# EasyEDA Pro project Dual_Motor_Driver_V3.1.eprj, schematic Schematic1
Board Name: PCB2; Create Date: 2025-08-30; Page Name: P1; Project Name: Dual_Motor_Driver_V3.1; Schematic Name: Schematic1; Update Date: 2025-08-31; Company: 嘉立创EDA; Page Size: A4; Version: V1.0
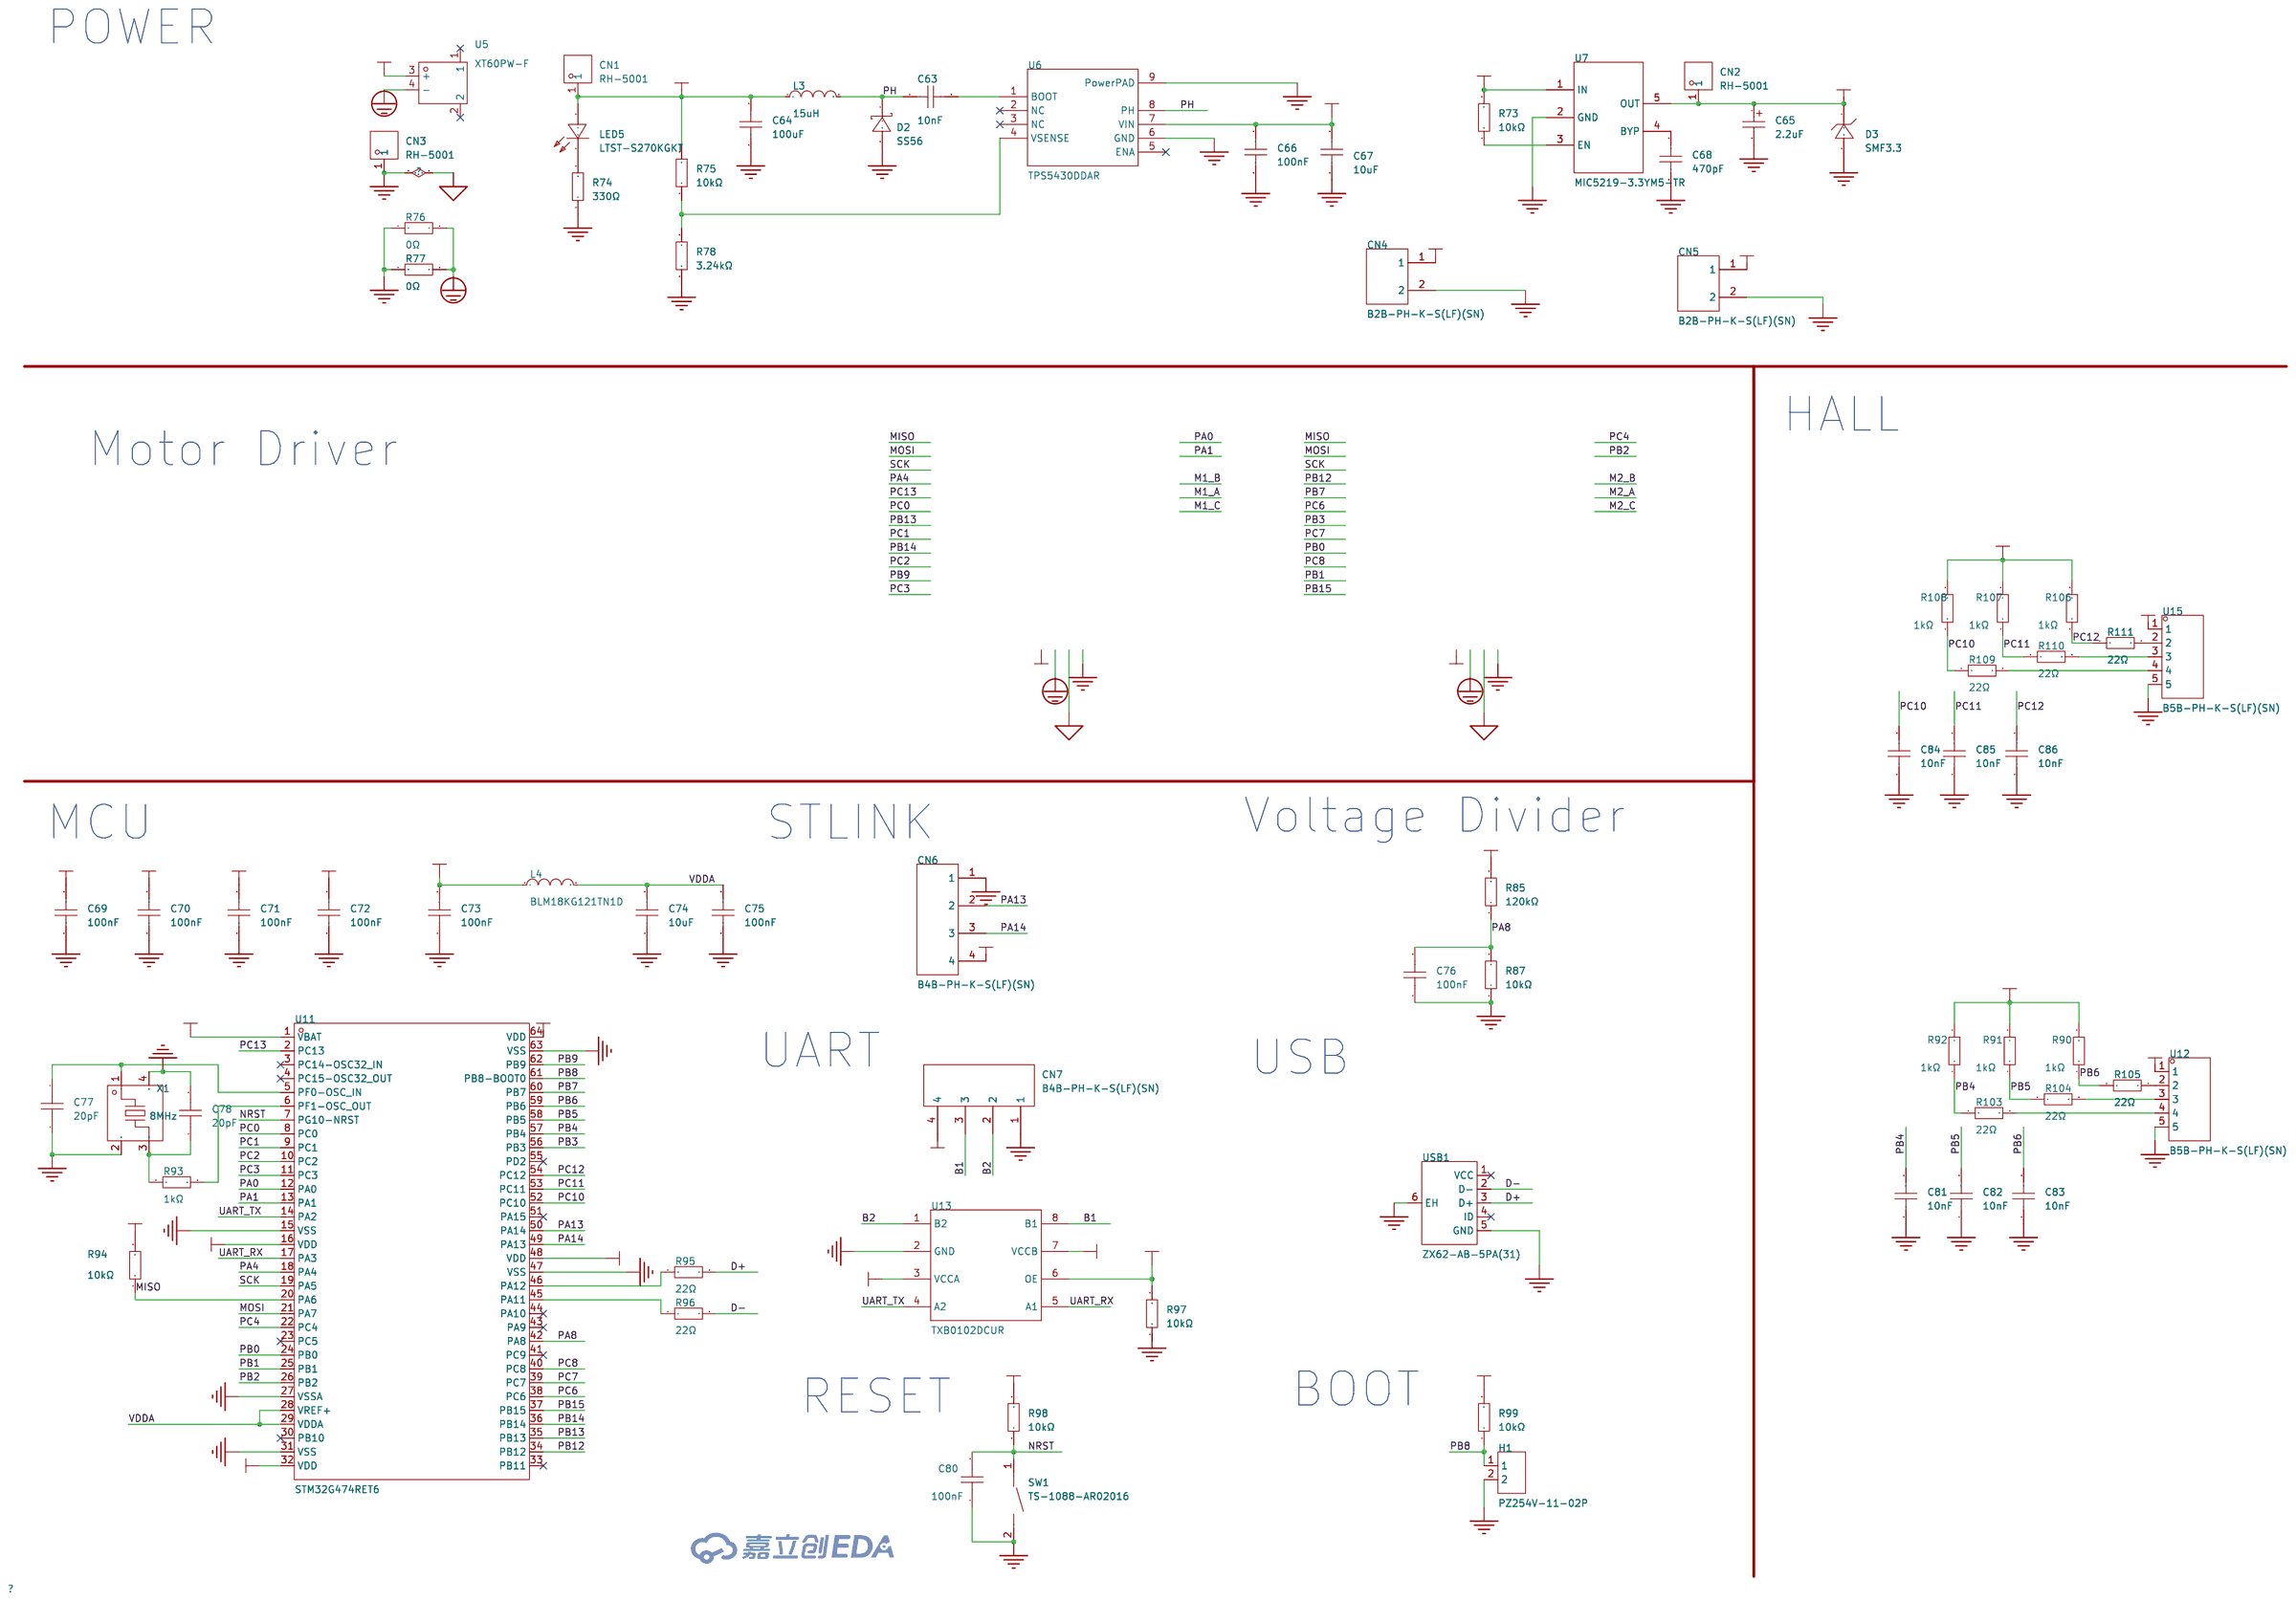
[diagram p1: schematic sheet]

## Parts
C63  10nF  [C0603]
C64  100uF  [CAP-SMD_BD6.3-L6.6-W6.6-LS7.2-R-RD]
C65  2.2uF  [CASE-A_3216]
C66  100nF  [C0603]
C67  10uF  [CAP-SMD_BD5.0-L5.3-W5.3-LS6.0-FD]
C68  470pF  [C0603]
C69  100nF  [C0603]
C70  100nF  [C0603]
C71  100nF  [C0603]
C72  100nF  [C0603]
C73  100nF  [C0603]
C74  10uF  [C0603]
C75  100nF  [C0603]
C76  100nF  [C1206]
C77  20pF  [C0603]
C78  20pF  [C0603]
C80  100nF  [C0603]
C81  10nF  [C0603]
C82  10nF  [C0603]
C83  10nF  [C0603]
C84  10nF  [C0603]
C85  10nF  [C0603]
C86  10nF  [C0603]
CBB1  -
CBB2  -
CN1  RH-5001  [TEST-TH_BD2.54-P1.4_BLACK]
CN2  RH-5001  [TEST-TH_BD2.54-P1.4_BLACK]
CN3  RH-5001  [TEST-TH_BD2.54-P1.4_BLACK]
CN4  B2B-PH-K-S(LF)(SN)  [CONN-TH_B2B-PH-K-S]
CN5  B2B-PH-K-S(LF)(SN)  [CONN-TH_B2B-PH-K-S]
CN6  B4B-PH-K-S(LF)(SN)  [CONN-TH_B4B-PH-K-S]
CN7  B4B-PH-K-S(LF)(SN)  [CONN-TH_B4B-PH-K-S]
D2  SS56  [SMA_L4.3-W2.6-LS5.2-RD]
D3  SMF3.3  [SOD-123FL_L3.0-W1.9-LS3.7-FD]
H1  PZ254V-11-02P  [HDR-TH_2P-P2.54-V-M]
L3  15uH  [IND-SMD_L10.8-W10.0_SLO1040H]
L4  BLM18KG121TN1D  [L0603]
LED5  LTST-S270KGKT  [LED-SMD_L1.7-W0.6-RD]
R73  10kΩ  [R0603]
R74  330Ω  [R0603]
R75  10kΩ  [R0603]
R76  0Ω  [R0603]
R77  0Ω  [R0603]
R78  3.24kΩ  [R0603]
R85  120kΩ  [R1206]
R87  10kΩ  [R1206]
R90  1kΩ  [R0603]
R91  1kΩ  [R0603]
R92  1kΩ  [R0603]
R93  1kΩ  [R0603]
R94  10kΩ  [R0603]
R95  22Ω  [R0603]
R96  22Ω  [R0603]
R97  10kΩ  [R0603]
R98  10kΩ  [R0603]
R99  10kΩ  [R0603]
R103  22Ω  [R0603]
R104  22Ω  [R0603]
R105  22Ω  [R0603]
R106  1kΩ  [R0603]
R107  1kΩ  [R0603]
R108  1kΩ  [R0603]
R109  22Ω  [R0603]
R110  22Ω  [R0603]
R111  22Ω  [R0603]
SW1  TS-1088-AR02016  [SW-SMD_L3.9-W3.0-P4.45]
U5  XT60PW-F  [TH_2P-XT60PW-F]
U6  TPS5430DDAR  [ESOP-8_L4.9-W3.9-P1.27-LS6.0-TL-EP]
U7  MIC5219-3.3YM5-TR  [SOT-23-5_L3.0-W1.7-P0.95-LS2.8-TL]
U11  STM32G474RET6  [LQFP-64_L10.0-W10.0-P0.50-LS12.0-BL]
U12  B5B-PH-K-S(LF)(SN)  [CONN-TH_B5B-PH-K-S-LF-SN]
U13  TXB0102DCUR  [VSSOP-8_L2.4-W2.1-P0.50-LS3.2-BR]
U15  B5B-PH-K-S(LF)(SN)  [CONN-TH_B5B-PH-K-S-LF-SN]
USB1  ZX62-AB-5PA(31)  [MICRO-USB-SMD_ZX62-AB-5PA]
X1  8MHz  [CRYSTAL-SMD_4P-L3.2-W2.5-BL]

## Library data of the parts
C63 = CC0603KRX7R9BB103: 容值:10nF;精度:±10%;额定电压:50V;材质(温度系数):X7R;; LCSC Part Name: 10nF ±10% 50V; Supplier Part: C100042; Manufacturer: YAGEO(国巨); Supplier Footprint: 0603; JLCPCB Part Class: Extended Part; Datasheet: https://atta.szlcsc.com/upload/public/pdf/source/20181008/C309510_22F155564471FAF6A489F7D68F34234E.pdf; Supplier: LCSC; Tolerance: ±10%; Voltage Rated: 50V; Temperature Coefficient: X7R
C64 = VZH101M1ETR-0607: LCSC Part Name: 100uF ±20% 25V; Supplier Part: C311617; Manufacturer: lelon(立隆); Supplier Footprint: SMD,6.3x7.7mm; JLCPCB Part Class: Extended Part; Datasheet: https://atta.szlcsc.com/upload/public/pdf/source/20180930/C311617_94F1283F4013E6085CC80C8D936B2FD6.pdf; Supplier: LCSC; Tolerance: ±20%; Rated Voltage: 25V; φD: 6.3mm; L: 7.7mm; Lifetime @ Temp: 2000hrs@105℃; Operating Temperature: -45℃~+105℃; Check: false
C65 = TAJA225K016RNJ: 容值:2.2uF;精度:±10%;额定电压:16V;等效串联电阻:6.5Ω@100kHz;; LCSC Part Name: 2.2uF ±10% 16V; Supplier Part: C7180; Manufacturer: Kyocera AVX; Supplier Footprint: CASE-A-3216; JLCPCB Part Class: 扩展库; Datasheet: https://atta.szlcsc.com/upload/public/pdf/source/20160107/1457707750344.pdf; Supplier: LCSC; Tolerance: ±10%; Rated Voltage: 16V; Equivalent Series Resistance(ESR): 6.5Ω@100kHz; Operating Temperature: -55℃~+125℃
C66 C69-C73 C75 C80 = CC0603KRX7R9BB104: 容值:100nF;精度:±10%;额定电压:50V;温度系数:X7R;; LCSC Part Name: 100nF ±10% 50V; Supplier Part: C14663; Manufacturer: YAGEO(国巨); Supplier Footprint: 0603; JLCPCB Part Class: Basic Part; Datasheet: https://atta.szlcsc.com/upload/public/pdf/source/20180910/C282072_33301C7F631E79921B82A8DAC6BCC5B3.pdf; Supplier: LCSC; Tolerance: ±10%; Voltage Rating: 50V; Temperature Coefficient: X7R
C67 = JVJ50v10M5x5: 容值:10uF;精度:±20%;额定电压:50V;纹波电流:18mA@120Hz;; LCSC Part Name: 10uF ±20% 50V; Supplier Part: C46550416; Manufacturer: 捷而瑞; Supplier Footprint: SMD,D5xL5.4mm; JLCPCB Part Class: Extended Part; Datasheet: https://atta.szlcsc.com/upload/public/pdf/source/20250526/372E583B5965CEB57A276EA554306514.pdf; Supplier: LCSC; Tolerance: ±20%; Voltage Rating: 50V; Ripple Current: 18mA@120Hz; Diameter: 5mm; Height - Seated (Max): 5.4mm; Operating Temperature: -55℃~+105℃
C68 = CC0603JRNPO9BN471: 容值:470pF;精度:±5%;额定电压:50V;材质(温度系数):NP0;; LCSC Part Name: 470pF ±5% 50V; Supplier Part: C106211; Manufacturer: YAGEO(国巨); Supplier Footprint: 0603; JLCPCB Part Class: Extended Part; Datasheet: https://atta.szlcsc.com/upload/public/pdf/source/20170505/1493957838062.pdf; Supplier: LCSC; Tolerance: ±5%; Voltage Rated: 50V; Temperature Coefficient: NP0
C74 = CL10A106KP8NNNC: 容值:10uF;精度:±10%;额定电压:10V;材质(温度系数):X5R;; LCSC Part Name: 10uF ±10% 10V; Supplier Part: C19702; Manufacturer: SAMSUNG(三星); Supplier Footprint: 0603; JLCPCB Part Class: Basic Part; Datasheet: https://atta.szlcsc.com/upload/public/pdf/source/20160218/1457707763339.pdf; Supplier: LCSC; Tolerance: ±10%; Voltage Rated: 10V; Temperature Coefficient: X5R
C76 = GRM31C5C1H104JA01L: 容值:100nF;精度:±5%;额定电压:50V;材质(温度系数):C0G;; LCSC Part Name: 100nF ±5% 50V; Supplier Part: C97946; Manufacturer: muRata(村田); Supplier Footprint: 1206; JLCPCB Part Class: Extended Part; Datasheet: https://atta.szlcsc.com/upload/public/pdf/source/20180228/C97946_15198056954501377706.pdf; Supplier: LCSC; Tolerance: ±5%; Voltage Rated: 50V; Temperature Coefficient: C0G
C77 C78 = CC0603FRNPO9BN200: 容值:20pF;精度:±1%;额定电压:50V;材质(温度系数):NP0;; LCSC Part Name: 20pF ±1% 50V; Supplier Part: C326779; Manufacturer: YAGEO(国巨); Supplier Footprint: 0603; JLCPCB Part Class: Extended Part; Datasheet: https://atta.szlcsc.com/upload/public/pdf/source/20181031/C326779_4C607DD48C96BB53EFC11FE773ED8662.pdf; Supplier: LCSC; Tolerance: ±1%; Voltage Rated: 50V; Temperature Coefficient: NP0
C81-C86 = CAP_0603: Supplier Footprint: 0603
CN1-CN3 = RH-5001: 测试针  高温尼龙/磷青铜镀银 5001测试点 100x80mm; LCSC Part Name: PCB电路板测试点/测试针; Supplier Part: C5199801; Manufacturer: 荣和; JLCPCB Part Class: 扩展库; Datasheet: https://atta.szlcsc.com/upload/public/pdf/source/20240125/4C7D900D13ECC10386B63F24462DBAAB.pdf; Supplier: LCSC; Connector Type: 插针型(穿板); Plastic Color: 黑色; Board Space (Diameter φ/ Length x Width): 2.5mm
CN4 CN5 = B2B-PH-K-S(LF)(SN): 插针结构:1x2P;间距:2mm;安装方式:直插;参考系列:PH;总PIN数:2P;排数:1;每排PIN数:2;行距:-;额定电流:2A;触头材质:黄铜;触头镀层:锡;工作温度范围:-25℃~+85℃;; LCSC Part Name: 1x2P 间距:2mm 直插 系列:PH; Supplier Part: C131337; Manufacturer: JST; Supplier Footprint: 插件,P=2mm; JLCPCB Part Class: 扩展库; Datasheet: https://atta.szlcsc.com/upload/public/pdf/source/20171026/C131342_15089839687311058815.pdf; Supplier: LCSC; Pins Structure: 1x2P; Pitch: 2mm; Mounting Type: 直插; Reference Series: PH; Number of Pins: 2P; Number of Rows: 1; Number of PINs Per Row: 2; Current Rating: 2A; Contact Material: 黄铜; Contact Plating: 锡; Operating Temperature: -25℃~+85℃; Voltage Rating: 100V; Plastic Material: PA66; Flame Retardant Rating: UL94V-0; Supplementary Features: 打K脚; Color: 白色; Z-Height of the Board: 6mm; X-Length of Bottom Edge on Board (Spacing Line): 5.9mm; Y-Width of Bottom Edge on Board: 4.5mm
CN6 CN7 = B4B-PH-K-S(LF)(SN): 插针结构:1x4P;间距:2mm;安装方式:直插;参考系列:PH;总PIN数:4P;排数:1;每排PIN数:4;行距:-;额定电流:2A;触头材质:黄铜;触头镀层:锡;工作温度范围:-25℃~+85℃;; LCSC Part Name: 1x4P 间距:2mm 直插 系列:PH; Supplier Part: C131334; Manufacturer: JST; Supplier Footprint: 插件,P=2mm; JLCPCB Part Class: 扩展库; Datasheet: https://atta.szlcsc.com/upload/public/pdf/source/20171026/C131342_15089839687311058815.pdf; Supplier: LCSC; Pins Structure: 1x4P; Pitch: 2mm; Mounting Style: 直插; Reference Series: PH; Number of Pins: 4P; Number of Rows: 1; Number of PINs Per Row: 4; Current Rating (Max): 2A; Contact Material: 黄铜; Contact Plating: 锡; Operating Temperature Range: -25℃~+85℃; Rated Voltage (Max): 100V; Plastic Material: PA66; Flame Retardant Rating: UL94V-0; Supplementary Features: 打K脚; Colour: 白色; Z-Height of the Board: 6mm; X-Length of Bottom Edge on Board (Spacing Line): 9.9mm; Y-Width of Bottom Edge on Board: 4.5mm
D2 = SS56_C65009: 二极管配置:独立式;正向压降(Vf):700mV@5A;直流反向耐压(Vr):60V;整流电流:5A;; LCSC Part Name: 电压:60V 电流:5A; Supplier Part: C65009; Manufacturer: MDD(辰达半导体); Supplier Footprint: SMA(DO-214AC); JLCPCB Part Class: Extended Part; Datasheet: https://atta.szlcsc.com/upload/public/pdf/source/20240710/73DFBB65C1883B895E62D589679033DF.pdf; Supplier: LCSC; Diode Configuration: 独立式; Forward Voltage (Vf@If): 700mV@5A; Reverse Voltage (Vr): 60V; Rectified Current: 5A; Reverse Leakage Current (Ir): 1mA@60V
D3 = SMF3.3: 反向截止电压(Vrwm):3.3V;最大钳位电压:6.8V;峰值脉冲电流(Ipp)@10/1000us:30A;峰值脉冲功率(Ppp)@10/1000us:200W;击穿电压:3.4V;; Supplier Part: C2649858; Manufacturer: Littelfuse(美国力特); Supplier Footprint: SOD-123FL; JLCPCB Part Class: Extended Part; Datasheet: https://atta.szlcsc.com/upload/public/pdf/source/20210611/50E5D37DD0B56B29EBADFDB41F7ACD9C.pdf; Supplier: LCSC; Reverse Stand-Off Voltage (Vrwm): 3.3V; Maximum Clamping Voltage: 6.8V; Peak Pulse Current (Ipp)@10/1000us: 30A; Peak Pulse Power Dissipation (Ppp)@10/1000us: 200W; Breakdown Voltage: 3.4V; Type: TVS
H1 = PZ254V-11-02P: 插针结构:1x2P;间距:2.54mm;行距:-;圆针/方针:方针;安装方式:直插;排数:单排;总PIN位数:2P;额定电流:-;额定电压:-;配合针长度:6mm;塑高:2.5mm;端接针长度:3mm;触头材质:黄铜;触头镀层:-;工作温度:-40℃~+105℃;颜色:黑色;; LCSC Part Name: 1x2P 间距:2.54mm 方针 直插; Supplier Part: C492401; Manufacturer: XFCN(兴飞); Supplier Footprint: 插件,P=2.54mm; JLCPCB Part Class: 扩展库; Datasheet: https://atta.szlcsc.com/upload/public/pdf/source/20200309/C492401_A812433581A9B211A7FFA413ADDFF0E5.pdf; Supplier: LCSC; Pin Structure: 1x2P; Pitch: 2.54mm; Circluar Pins/Square Pins: 方针; Mounting Type: 直插; Number of Rows: 单排; Number of Pins: 2P; Length of Mating Pin: 6mm; Insulation Height: 2.5mm; Length of End Connection Pin: 3mm; Contact Material: 黄铜; Operating Temperature: -40℃~+105℃; Color: 黑色
L3 = SLO1040H150MTT: 精度:±20%;额定电流:4.5A;直流电阻(DCR):45mΩ;电感值:15uH;; LCSC Part Name: 15uH ±20%; Supplier Part: C182184; Manufacturer: Sunltech(韩国顺磁); Supplier Footprint: SMD; JLCPCB Part Class: Extended Part; Datasheet: https://atta.szlcsc.com/upload/public/pdf/source/20180227/C182184_15197211288301371908.pdf; Supplier: LCSC; Width: 10mm; Tolerance: ±20%; Length: 10.8mm; Rated Current: 4.5A; DC Resistance (DCR): 45mΩ; Height: 4mm; Check: false
L4 = BLM18KG121TN1D: 标称阻抗@测试频率:120Ω@100MHz;误差:±25%;直流电阻(RDC):30mΩ;; LCSC Part Name: 单路 0603磁珠 阻抗120Ω@100MHz; Supplier Part: C85831; Manufacturer: muRata(村田); Supplier Footprint: 0603; JLCPCB Part Class: 扩展库; Datasheet: https://atta.szlcsc.com/upload/public/pdf/source/20180329/C160981_FD3C2D2622A377E203B89F4AA32B0741.pdf; Supplier: LCSC; Impedance @ Frequency: 120Ω@100MHz; Tolerance: ±25%; DC Resistance: 30mΩ; Current Rating: 3A; Circuits: 1
LED5 = LTST-S270KGKT: 发光颜色:黄绿色;功率:75mW;正向电流:20mA;主波长:571nm;二极管配置:-;透镜颜色:无色透明透镜;色温:-;发光角度:130°;载带方式:侧贴;工作温度:-30℃~+85℃;; LCSC Part Name: 普绿/黄绿 侧贴; Supplier Part: C125113; Manufacturer: LITEON(光宝); Supplier Footprint: SMD,1.2x1.6mm; JLCPCB Part Class: 扩展库; Datasheet: https://atta.szlcsc.com/upload/public/pdf/source/20180104/C125113_15150602232371230485.pdf; Supplier: LCSC; Emitted Color: 黄绿色; Power Dissipation: 75mW; Forward Current: 20mA; Dominant Wavelength: 571nm; Peak Wavelength: 574nm; Lens Color: 无色透明透镜; Viewing Angle: 130°; Mounting Sytle: 侧贴; Operating Temperature: -30℃~+85℃
R73 R75 R94 R97-R99 = 0603WAF1002T5E: 电阻类型:厚膜电阻;阻值:10kΩ;精度:±1%;功率:100mW;工作电压:75V;温度系数:±100ppm/℃;; LCSC Part Name: 厚膜电阻 10kΩ ±1% 100mW; Supplier Part: C25804; Manufacturer: UNI-ROYAL(厚声); Supplier Footprint: 0603; JLCPCB Part Class: Basic Part; Datasheet: https://atta.szlcsc.com/upload/public/pdf/source/20200306/C422600_1E6D84923E4A46A82E41ADD87F860B5C.pdf; Supplier: LCSC; Type: 厚膜电阻; Tolerance: ±1%; Power(Watts): 100mW; Overload Voltage (Max): 75V; Temperature Coefficient: ±100ppm/℃; Operating Temperature Range: -55℃~+155℃; Voltage-Supply(Max): 75V; Operating Temperature: -55℃~+155℃
R74 = 0603WAF3300T5E: 电阻类型:厚膜电阻;阻值:330Ω;精度:±1%;功率:100mW;最大工作电压:75V;温度系数:±100ppm/℃;; LCSC Part Name: 330Ω ±1% 100mW 厚膜电阻; Supplier Part: C23138; Manufacturer: UNI-ROYAL(厚声); Supplier Footprint: 0603; JLCPCB Part Class: Basic Part; Datasheet: https://atta.szlcsc.com/upload/public/pdf/source/20200306/C422600_1E6D84923E4A46A82E41ADD87F860B5C.pdf; Supplier: LCSC; Type: 厚膜电阻; Tolerance: ±1%; Power(Watts): 100mW; Overload Voltage (Max): 75V; Temperature Coefficient: ±100ppm/℃; Operating Temperature Range: -55℃~+155℃
R76 R77 = RC0603FR-070RL: 电阻类型:厚膜电阻;阻值:0Ω;精度:±1%;功率:100mW;最大工作电压:75V;温度系数:-;; LCSC Part Name: 厚膜电阻 0Ω ±1% 100mW; Supplier Part: C100044; Manufacturer: YAGEO(国巨); Supplier Footprint: 0603; JLCPCB Part Class: Extended Part; Datasheet: https://atta.szlcsc.com/upload/public/pdf/source/20180316/70C0E2BDAE7FCC62C531A5A58D202EE1.pdf; Supplier: LCSC; Type: 厚膜电阻; Tolerance: ±1%; Power(Watts): 100mW; Overload Voltage (Max): 75V; Operating Temperature Range: -55℃~+155℃
R78 = 0603WAF3241T5E: 电阻类型:厚膜电阻;阻值:3.24kΩ;精度:±1%;功率:100mW;最大工作电压:75V;温度系数:±100ppm/℃;; LCSC Part Name: 3.24kΩ ±1% 100mW 厚膜电阻; Supplier Part: C22994; Manufacturer: UNI-ROYAL(厚声); Supplier Footprint: 0603; JLCPCB Part Class: Extended Part; Datasheet: https://atta.szlcsc.com/upload/public/pdf/source/20200306/C422600_1E6D84923E4A46A82E41ADD87F860B5C.pdf; Supplier: LCSC; Type: 厚膜电阻; Tolerance: ±1%; Power(Watts): 100mW; Overload Voltage (Max): 75V; Temperature Coefficient: ±100ppm/℃; Operating Temperature Range: -55℃~+155℃
R85 = 1206W4F1203T5E: 电阻类型:厚膜电阻;阻值:120kΩ;精度:±1%;功率:250mW;最大工作电压:200V;温度系数:±100ppm/℃;; LCSC Part Name: 120kΩ ±1% 250mW 厚膜电阻; Supplier Part: C17908; Manufacturer: UNI-ROYAL(厚声); Supplier Footprint: 1206; JLCPCB Part Class: Extended Part; Datasheet: https://atta.szlcsc.com/upload/public/pdf/source/20200306/C422600_1E6D84923E4A46A82E41ADD87F860B5C.pdf; Supplier: LCSC; Type: 厚膜电阻; Tolerance: ±1%; Power(Watts): 250mW; Overload Voltage (Max): 200V; Temperature Coefficient: ±100ppm/℃; Operating Temperature Range: -55℃~+155℃
R87 = 1206W4F1002T5E: 电阻类型:厚膜电阻;阻值:10kΩ;精度:±1%;功率:250mW;最大工作电压:200V;温度系数:±100ppm/℃;; LCSC Part Name: 10kΩ ±1% 250mW 厚膜电阻; Supplier Part: C17902; Manufacturer: UNI-ROYAL(厚声); Supplier Footprint: 1206; JLCPCB Part Class: Basic Part; Datasheet: https://atta.szlcsc.com/upload/public/pdf/source/20200306/C422600_1E6D84923E4A46A82E41ADD87F860B5C.pdf; Supplier: LCSC; Type: 厚膜电阻; Tolerance: ±1%; Power(Watts): 250mW; Overload Voltage (Max): 200V; Temperature Coefficient: ±100ppm/℃; Operating Temperature Range: -55℃~+155℃
R90-R92 R106-R108 = 0603WAF1002T5E: LCSC Part Name: 10kΩ ±1% 100mW; Supplier Part: C25804; Manufacturer: UNI-ROYAL(厚声); Supplier Footprint: 0603; JLCPCB Part Class: Basic Part; Datasheet: https://atta.szlcsc.com/upload/public/pdf/source/20200306/C422600_1E6D84923E4A46A82E41ADD87F860B5C.pdf; Supplier: LCSC; Type: 厚膜电阻; Tolerance: ±1%; Power(Watts): 100mW; Temperature Coefficient: ±100ppm/℃; Overload Voltage (Max): 75V; Operating Temperature Range: -55℃~+155℃
R93 = 0603WAF1001T5E: 电阻类型:厚膜电阻;阻值:1kΩ;精度:±1%;功率:100mW;最大工作电压:75V;温度系数:±100ppm/℃;; LCSC Part Name: 1kΩ ±1% 100mW 厚膜电阻; Supplier Part: C21190; Manufacturer: UNI-ROYAL(厚声); Supplier Footprint: 0603; JLCPCB Part Class: Basic Part; Datasheet: https://atta.szlcsc.com/upload/public/pdf/source/20200306/C422600_1E6D84923E4A46A82E41ADD87F860B5C.pdf; Supplier: LCSC; Type: 厚膜电阻; Tolerance: ±1%; Power(Watts): 100mW; Overload Voltage (Max): 75V; Temperature Coefficient: ±100ppm/℃; Operating Temperature Range: -55℃~+155℃
R95 R96 = 0603WAF220JT5E: 电阻类型:厚膜电阻;阻值:22Ω;精度:±1%;功率:100mW;最大工作电压:75V;温度系数:±100ppm/℃;; LCSC Part Name: 22Ω ±1% 100mW 厚膜电阻; Supplier Part: C23345; Manufacturer: UNI-ROYAL(厚声); Supplier Footprint: 0603; JLCPCB Part Class: Basic Part; Datasheet: https://atta.szlcsc.com/upload/public/pdf/source/20200306/C422600_1E6D84923E4A46A82E41ADD87F860B5C.pdf; Supplier: LCSC; Type: 厚膜电阻; Tolerance: ±1%; Power(Watts): 100mW; Overload Voltage (Max): 75V; Temperature Coefficient: ±100ppm/℃; Operating Temperature Range: -55℃~+155℃
R103-R105 R109-R111 = Res_0603: Supplier Footprint: 0603
SW1 = TS-1088-AR02016: 电路结构:单刀单掷;按钮形状:圆形按钮;作用力:160gf;安装方式:立贴;开关长度:4mm;开关宽度:3mm;开关高度:2mm;带支架:不带;触点电流:50mA;额定电压(DC):12V;绝缘电阻:100MΩ;机械寿命:10万次;; LCSC Part Name: 4*3*2mm 立贴 轻触开关; Supplier Part: C720477; Manufacturer: XUNPU(讯普); Supplier Footprint: SMD; JLCPCB Part Class: 基础库; Datasheet: https://atta.szlcsc.com/upload/public/pdf/source/20200810/C720475_60D09DD6C54279ADDB2DC25100F1CC11.pdf; Supplier: LCSC; Circuit: 单刀单掷; Actuator Style: 圆形按钮; Operating Force: 160gf; Mounting Style: 立贴; Switch Length: 4mm; Switch Width: 3mm; Switch Height: 2mm; Strike Gundam: 不带; Contact Current: 50mA; Voltage Rating (DC): 12V; Insulation Resistance: 100MΩ; Actuator/Cap Color: 黑色; Pin Style: SMD接片; Mechanical Life: 10万次; Operating Temperature: -30℃~+80℃
U5 = XT60PW-F: 类别:-;类型1:-;; LCSC Part Name: AMASS(艾迈斯)插头连接器锂电池组充电接口 航模电调卧式焊板 母头 XT60PW-F; Supplier Part: C428722; Manufacturer: AMASS(艾迈斯); JLCPCB Part Class: 扩展库; Datasheet: https://atta.szlcsc.com/upload/public/pdf/source/20190916/C428722_DFF78979486FCB0B58C1FC563067EC88.pdf; Supplier: LCSC; Type: 卧式插头; Colour: 黄色; InterfaceType: 母头
U6 = TPS5430DDAR: 功能类型:降压型;输出类型:可调;工作电压:5.5V~36V;输出电压:1.221V~32.04V;输出电流:3A;; LCSC Part Name: 宽输入范围、3A输出电流的降压转换器; Supplier Part: C9864; Manufacturer: TI(德州仪器); Supplier Footprint: SOIC-8-EP; JLCPCB Part Class: 基础库; Datasheet: https://www.ti.com/cn/lit/gpn/tps5430; Supplier: LCSC; Function: 降压型; Output Type: 可调; Input Voltage: 5.5V~36V; Output Voltage: 1.221V~32.04V; Output Current: 3A; Switching Frequency: 500kHz; Operating Temperature: -40℃~+125℃@(TJ); Synchronous Rectification: 否; Number of Outputs: 1; Topology: 降压式; Switch tube (built-in/external): 内置
U7 = MIC5219-3.3YM5-TR: 输出类型:固定;最大输入电压:12V;输出电压:3.3V;输出电流:500mA;电源纹波抑制比(PSRR):75dB@(120Hz);输出极性:正极;; LCSC Part Name: 500mA峰值输出低压差线性稳压器; Supplier Part: C29613; Manufacturer: MICROCHIP(美国微芯); Supplier Footprint: SOT-23-5; JLCPCB Part Class: 扩展库; Datasheet: https://atta.szlcsc.com/upload/public/pdf/source/20180115/C144182_15159955638901266895.pdf; Supplier: LCSC; Output Type: 固定; Maximum Input Voltage: 12V; Output Voltage: 3.3V; Output Current: 500mA; Power Supply Rejection Ratio (PSRR): 75dB@(120Hz); Dropout Voltage: 600mV@(500mA); standby current: 8uA; Feature: 浪涌保护；热保护(TSD)；过流保护(OCP)；带使能; Operating Temperature: -40℃~+125℃; Output Polarity: 正极; Number of Outputs: 1
U11 = STM32G474RET6: CPU内核:ARM-M4;CPU最大主频:170MHz;应用领域:-;; LCSC Part Name: 带DSP和FPU的170MHz主流ARM Cortex-M4 MCU，具有512 KB Flash存储器、数学加速器、高分辨率定时器和高模拟电平集成; Supplier Part: C521608; Manufacturer: ST(意法半导体); Supplier Footprint: LQFP-64(10x10); JLCPCB Part Class: 扩展库; Datasheet: https://atta.szlcsc.com/upload/public/pdf/source/20200902/C431632_38212262685EE30B1989689374F08940.pdf; Supplier: LCSC; CPU Core: ARM-M4; CPU Maximum Speed: 170MHz; Program Storage Size: 512KB; Program Memory Type: FLASH; Number of I/O: 52; ADC (Bit): 12bit; DAC (Bit): 12bit; Voltage - Supply: 1.71V~3.6V
U12 U15 = B5B-PH-K-S(LF)(SN): 插针结构:1x5P;间距:2mm;安装方式:直插;参考系列:PH;总PIN数:5P;排数:1;每排PIN数:5;行距:-;额定电流:2A;触头材质:黄铜;触头镀层:锡;工作温度范围:-25℃~+85℃;; LCSC Part Name: 1x5P 间距:2mm 直插 系列:PH; Supplier Part: C157993; Manufacturer: JST; Supplier Footprint: 插件,P=2mm; JLCPCB Part Class: 扩展库; Datasheet: https://atta.szlcsc.com/upload/public/pdf/source/20181010/C265101_22107ACC4D8714694FDA2DD97145FA81.pdf; Supplier: LCSC; Pins Structure: 1x5P; Pitch: 2mm; Mounting Style: 直插; Reference Series: PH; Number of Pins: 5P; Number of Rows: 1; Number of PINs Per Row: 5; Current Rating (Max): 2A; Contact Material: 黄铜; Contact Plating: 锡; Operating Temperature Range: -25℃~+85℃; Rated Voltage (Max): 100V; Plastic Material: PA66; Flame Retardant Rating: UL94V-0; Supplementary Features: 打K脚; Colour: 白色; Z-Height of the Board: 6mm; X-Length of Bottom Edge on Board (Spacing Line): 11.9mm; Y-Width of Bottom Edge on Board: 4.5mm
U13 = TXB0102DCUR: 数据速率:100Mbps;工作电压(VCCA):1.2V~3.6V;工作电压(VCCB):1.65V~5.5V;通道数:1;每个电路通道数:2;; LCSC Part Name: 100Mbps 2位双向电平转换器; Supplier Part: C60709; Manufacturer: TI(德州仪器); Supplier Footprint: VSSOP-8-0.5mm; JLCPCB Part Class: 扩展库; Datasheet: https://www.ti.com/cn/lit/gpn/txb0102; Supplier: LCSC; Channel Type: 双向; Data Rate: 100Mbps; Voltage - Supply(VCCA): 1.2V~3.6V; Voltage - Supply(VCCB): 1.65V~5.5V; Number of Circuits: 2; Output Type: 三态; Operating Temperature: -40℃~+85℃; Features: 自动方向检测
USB1 = ZX62-AB-5PA(31): 连接器类型:Micro-AB;标准:USB 2.0;公母:母;端口数量:1;触点数量:5P;安装方式:卧贴;额定电流 - 电源:-;工作温度范围:-30℃~+85℃;; LCSC Part Name: Micro-AB 母 卧贴; Supplier Part: C2692071; Manufacturer: HRS(广濑); Supplier Footprint: SMD; JLCPCB Part Class: 扩展库; Datasheet: https://atta.szlcsc.com/upload/public/pdf/source/20210423/C2692071_32DBDBFD7D872D0BE7B442E19BCECF87.pdf; Supplier: LCSC; Connector Type: Micro-AB; Standard: USB 2.0; Gender: 母; Number of Ports: 1; Number of Contacts: 5P; Mounting Style: 卧贴; Operating Temperature Range: -30℃~+85℃
X1 = X32258MSB4SI: 晶振类型:贴片晶振;频率:8MHz;常温频差:±10ppm;负载电容:20pF;频率稳定度:±20ppm;; LCSC Part Name: YSX321SL 8MHZ 4P 3225 20PF ±10PPM -40~85℃ (±20PPM); Supplier Part: C2682774; Manufacturer: YXC(扬兴晶振); Supplier Footprint: SMD3225-4P; JLCPCB Part Class: 扩展库; Datasheet: https://atta.szlcsc.com/upload/public/pdf/source/20240329/19D5F850207469550BEB00D7DFEDBC7A.pdf; Supplier: LCSC; Type: 贴片晶振; Normal temperature Frequency Tolerance: ±10ppm; Load Capacitance: 20pF; Frequency Stability: ±20ppm; Equivalent Series Resistance(ESR): 120Ω; Operating Temperature: -40℃~+85℃

## Nets
3.3V: C65.1 C69.2 C70.2 C71.2 C72.2 C73.2 CN2.1 CN5.1 CN6.4 D3.1 L4.1 R90.2 R91.2 R92.2 R94.2 R97.2 R98.2 R99.2 R106.2 R107.2 R108.2 U7.5(OUT) U11.1(VBAT) U11.16(VDD) U11.32(VDD) U11.48(VDD) U11.64(VDD) U13.3(VCCA) U13.6(OE)
5V: C64.1 CN1.1 CN4.1 CN7.4 L3.1 LED5.2(A) R73.2 R75.2 U7.1(IN) U12.1 U13.7(VCCB) U15.1
AGND: C64.2 C65.2 C66.1 C66.2 C67.1 C67.2 C68.1 C69.1 C70.1 C71.1 C72.1 C73.1 C74.1 C75.1 C76.1 C77.2 C78.2 C80.1 C81.1 C82.1 C83.1 C84.1 C85.1 C86.1 CBB1.(GND) CBB2.(GND) CN3.1 CN4.2 CN5.2 CN6.1 CN7.1 D2.2(A) D3.2 H1.2 R74.1 R76.1 R76.2 R77.1 R77.2 R78.1 R85.2 R87.1 R94.1 R97.1 SW1.2 U5.3(+) U5.4(-) U6.6(GND) U6.7(VIN) U6.9(PowerPAD) U7.2(GND) U11.2(PC13) U11.8(PC0) U11.9(PC1) U11.10(PC2) U11.11(PC3) U11.12(PA0) U11.13(PA1) U11.15(VSS) U11.18(PA4) U11.19(PA5) U11.20(PA6) U11.21(PA7) U11.22(PC4) U11.24(PB0) U11.25(PB1) U11.26(PB2) U11.27(VSSA) U11.31(VSS) U11.34(PB12) U11.35(PB13) U11.36(PB14) U11.37(PB15) U11.38(PC6) U11.39(PC7) U11.40(PC8) U11.47(VSS) U11.56(PB3) U11.60(PB7) U11.62(PB9) U11.63(VSS) U12.5 U13.2(GND) U15.5 USB1.5(GND) USB1.6(EH) X1.2(GND) X1.4(GND)
VDDA: C74.2 C75.2 L4.2 U11.28(VREF+) U11.29(VDDA)
B1: CN7.3 U13.8(B1)
B2: CN7.2 U13.1(B2)
D+: R95.2 USB1.3(D+)
D-: R96.2 USB1.2(D-)
NRST: C80.2 R98.1 SW1.1 U11.7(PG10-NRST)
PA8: C76.2 R85.1 R87.2 U11.42(PA8)
PA13: CN6.2 U11.50(PA14)
PA14: CN6.3 U11.49(PA13)
PB4: C81.2 R92.1 R103.1 U11.57(PB4)
PB5: C82.2 R91.1 R104.1 U11.58(PB5)
PB6: C83.2 R90.1 R105.1 U11.59(PB6)
PB8: H1.1 R99.1 U11.61(PB8-BOOT0)
PC10: C84.2 R108.1 R109.1 U11.52(PC10)
PC11: C85.2 R107.1 R110.1 U11.53(PC11)
PC12: C86.2 R106.1 R111.1 U11.54(PC12)
PH: C63.1 D2.1(K) L3.2 U6.8(PH)
UART_RX: U11.17(PA3) U13.5(A1)
UART_TX: U11.14(PA2) U13.4(A2)
$1N551: R75.1 R78.2 U6.4(VSENSE)
$1N561: C63.2 U6.1(BOOT)
$1N2428: C68.2 U7.4(BYP)
$1N2597: R73.1 U7.3(EN)
$1N72792: C77.1 U11.5(PF0-OSC_IN) X1.1
$1N72945: R93.2 U11.6(PF1-OSC_OUT)
$1N72949: C78.1 R93.1 X1.3
$1N77944: R95.1 U11.46(PA12)
$1N77945: R96.1 U11.45(PA11)
$1N87601: LED5.1(K) R74.2
$1N97516: R103.2 U12.4
$1N97530: R104.2 U12.3
$1N97534: R105.2 U12.2
$1N98528: R109.2 U15.4
$1N98530: R110.2 U15.3
$1N98532: R111.2 U15.2

Not connected (* = marked no-connect by the designer): U5 1* 2*; U6 2(NC)* 3(NC)* 5(ENA)*; U11 3(PC14-OSC32_IN)* 4(PC15-OSC32_OUT)* 23(PC5)* 30(PB10)* 33(PB11)* 41(PC9)* 43(PA9)* 44(PA10)* 51(PA15)* 55(PD2)*; USB1 1(VCC)* 4(ID)*

## Notes on the sheet
- POWER
- HALL
- Motor Driver
- Voltage Divider
- MCU
- STLINK
- UART
- USB
- BOOT
- RESET
